# EAGLE design DigitalClockController (EAGLE 9.6.2)
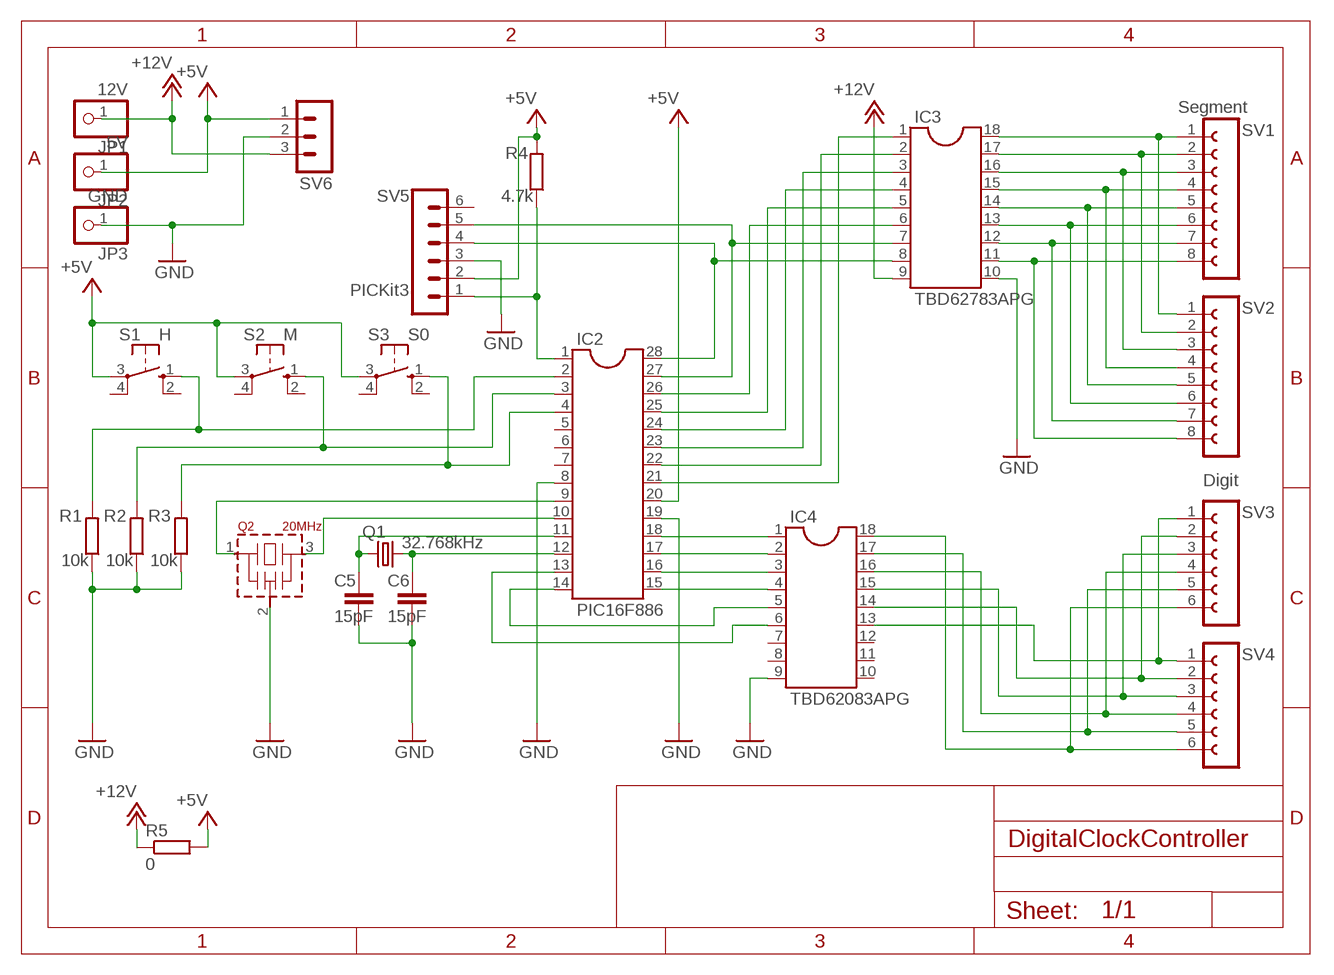
[diagram p0: schematic, sheet 1]

## Parts
C5  15pF  C-EU025-024X044  [C025-024X044]
C6  15pF  C-EU025-024X044  [C025-024X044]
IC2  PIC16F886  DIL28-3  [DIL28-3]
IC3  TBD62783APG  DIL18  [DIL18]
IC4  TBD62083APG  DIL18  [DIL18]
JP1  12V  PINHD-1X1  [1X01]
JP2  5V  PINHD-1X1  [1X01]
JP3  GND  PINHD-1X1  [1X01]
Q1  32.768kHz  CRYSTALTC26H  [TC26H]
Q2  20MHz  CSTLS_X  [CSTLS_X]
R1  10k  R-EU_0207/10  [0207/10]
R2  10k  R-EU_0207/10  [0207/10]
R3  10k  R-EU_0207/10  [0207/10]
R4  4.7k  R-EU_0207/10  [0207/10]
R5  0  R-EU_0207/10  [0207/10]
S1  H  10-XX  [B3F-10XX]
S2  M  10-XX  [B3F-10XX]
S3  S0  10-XX  [B3F-10XX]
SV1  Segment  FE08-1  [FE08]
SV2  Segment  FE08-1  [FE08]
SV3  Digit  FE06-1  [FE06]
SV4  Digit  FE06-1  [FE06]
SV5  PICKit3  MA06-1  [MA06-1]
SV6  MA03-1  [MA03-1]

## Nets
+5V: IC2.20 JP2.1 R4.2 R5.2 S1.3(P) S2.3(P) S3.3(P) SV5.2 SV6.1
+12V: IC3.9 JP1.1 R5.1 SV6.3
GND: C5.2 C6.2 IC2.8 IC2.19 IC3.10 IC4.9 JP3.1 Q2.2(VSS) R1.1 R2.1 R3.1 SV5.3 SV6.2
N$1: C5.1 IC2.11 Q1.2
N$2: C6.1 IC2.12 Q1.1
N$3: IC2.10 Q2.3
N$4: IC2.9 Q2.1
N$5: IC2.2 R1.2 S1.1(S)
N$6: IC2.3 R2.2 S2.1(S)
N$7: IC2.4 R3.2 S3.1(S)
N$8: IC2.1 R4.1 SV5.1
N$9: IC3.18 SV1.1 SV2.1
N$10: IC3.17 SV1.2 SV2.2
N$11: IC3.16 SV1.3 SV2.3
N$12: IC3.15 SV1.4 SV2.4
N$13: IC2.26 IC3.6
N$14: IC2.27 IC3.7 SV5.5
N$15: IC2.25 IC3.5
N$16: IC2.14 IC4.5
N$17: IC2.13 IC4.6
N$18: IC2.15 IC4.4
N$19: IC2.18 IC4.1
N$20: IC2.17 IC4.2
N$21: IC2.16 IC4.3
N$22: IC2.24 IC3.4
N$23: IC2.23 IC3.3
N$24: IC2.22 IC3.2
N$25: IC2.21 IC3.1
N$27: IC3.14 SV1.5 SV2.5
N$28: IC3.13 SV1.6 SV2.6
N$29: IC3.12 SV1.7 SV2.7
N$30: IC3.11 SV1.8 SV2.8
N$31: IC4.13 SV3.1 SV4.1
N$32: IC4.14 SV3.2 SV4.2
N$33: IC4.15 SV3.3 SV4.3
N$34: IC4.16 SV3.4 SV4.4
N$35: IC4.17 SV3.5 SV4.5
N$36: IC4.18 SV3.6 SV4.6
N$37: IC2.28 IC3.8 SV5.4
Unconnected: IC2.5 IC2.6 IC2.7 IC4.7 IC4.8 IC4.10 IC4.11 IC4.12 S1.2(S1) S1.4(P1) S2.2(S1) S2.4(P1) S3.2(S1) S3.4(P1) SV5.6

## Library data of the parts
C5 C6 = rcl:C-EU: CAPACITOR, European symbol; SPICEPREFIX: C
IC2 = ic-package:DIL28: Dual In Line
IC3 IC4 = ic-package:DIL18: Dual In Line / Socket
JP1-JP3 = pinhead:PINHD-1X1: PIN HEADER
Q1 = crystal:CRYSTAL: CRYSTAL; OC_FARNELL: unknown; OC_NEWARK: unknown
Q2 = murata-resonators:CSTLS_X: Ceramic resonator 16.00 to 70.00 MHz
R1-R5 = rcl:R-EU_: RESISTOR, European symbol; SPICEPREFIX: R
S1-S3 = switch-omron:10-XX: OMRON SWITCH; MPN: B3F-1000; OC_FARNELL: 176432; OC_NEWARK: 36M3542
SV1 SV2 = con-lsta:FE08-1: FEMALE HEADER; OC_FARNELL: unknown; OC_NEWARK: unknown
SV3 SV4 = con-lsta:FE06-1: FEMALE HEADER; OC_FARNELL: unknown; OC_NEWARK: unknown
SV5 = con-lstb:MA06-1: PIN HEADER; OC_FARNELL: unknown; OC_NEWARK: unknown
SV6 = con-lstb:MA03-1: PIN HEADER; OC_FARNELL: unknown; OC_NEWARK: unknown

## Board
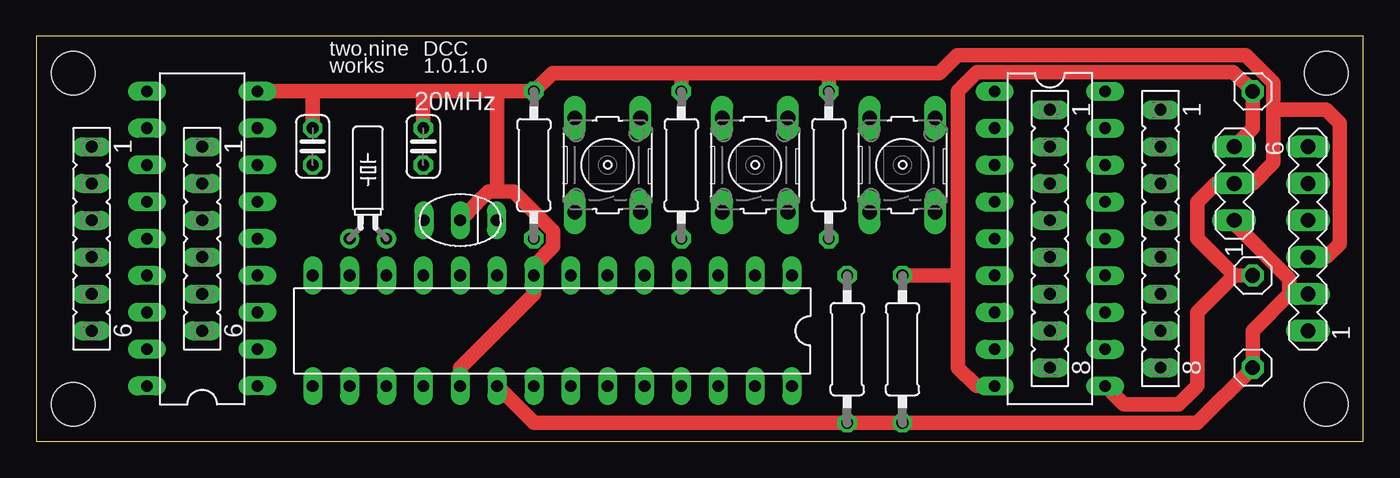
[diagram p1: board, top side]
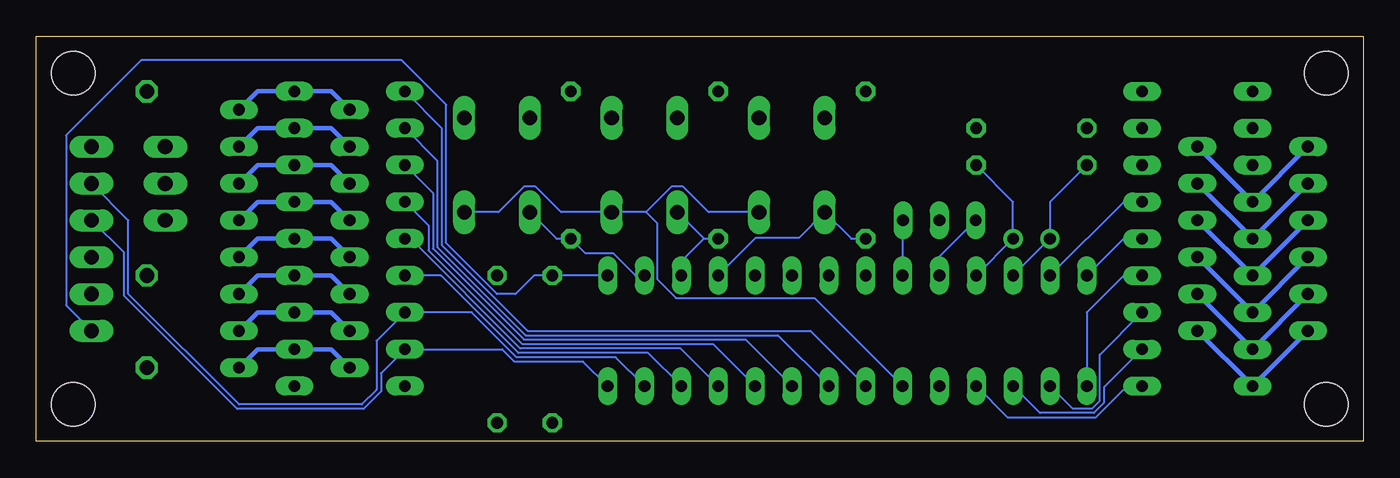
[diagram p2: board, bottom side, seen from below]

Size 91.44 x 27.93 mm. Coordinates in mm from the lower left corner, seen from the top.
Outline: 0,0 91.44,0 91.44,27.93 0,27.93 0,0
Copper layers (1*16): Top 0.035mm / dielectric 1.5mm / Bottom 0.035mm
Design rules "SeeedStudio_2layer_DRU_no_angle_20140221": minimum track width 6mil, minimum drill 12mil, track to track 6mil, track to pad 6mil, pad to pad 6mil, via to via 6mil, smd to smd 0mil, copper to edge 10mil, drill to drill 10mil, minimum pad ring 10mil, minimum via ring 6mil, stop-mask expansion 2mil, vias tented up to drill 100mil, thermal gap 10mil
Holes 3 mm at 2.54,25.4 2.54,2.54 88.9,2.54 88.9,25.4

### Footprints (pad centres in the part's own frame; a part is rotated, then mirrored left to right if it is on the bottom)
C025-024X044 = drill 0.813 octagon: 1 -1.27,0; 2 1.27,0
DIL28-3 = drill 0.813 long: 1 -16.51,-3.81; 2 -13.97,-3.81; 3 -11.43,-3.81; 4 -8.89,-3.81; 5 -6.35,-3.81; 6 -3.81,-3.81; 7 -1.27,-3.81; 8 1.27,-3.81; 9 3.81,-3.81; 10 6.35,-3.81; 11 8.89,-3.81; 12 11.43,-3.81; 13 13.97,-3.81; 14 16.51,-3.81; 15 16.51,3.81; 16 13.97,3.81; 17 11.43,3.81; 18 8.89,3.81; 19 6.35,3.81; 20 3.81,3.81; 21 1.27,3.81; 22 -1.27,3.81; 23 -3.81,3.81; 24 -6.35,3.81; 25 -8.89,3.81; 26 -11.43,3.81; 27 -13.97,3.81; 28 -16.51,3.81
DIL18 = drill 0.813 long: 1 -10.16,-3.81; 2 -7.62,-3.81; 3 -5.08,-3.81; 4 -2.54,-3.81; 5 0,-3.81; 6 2.54,-3.81; 7 5.08,-3.81; 8 7.62,-3.81; 9 10.16,-3.81; 10 10.16,3.81; 11 7.62,3.81; 12 5.08,3.81; 13 2.54,3.81; 14 0,3.81; 15 -2.54,3.81; 16 -5.08,3.81; 17 -7.62,3.81; 18 -10.16,3.81
1X01 = drill 1.016 octagon: 1 0,0
TC26H = drill 0.813: 1 -1.27,0; 2 1.27,0
CSTLS_X = drill 0.813 long: 1 -2.5,0; 2 0,0; 3 2.5,0
0207/10 = drill 0.813 octagon: 1 -5.08,0; 2 5.08,0
B3F-10XX = drill 1.016 long: 1 -3.251,2.261; 2 3.251,2.261; 3 -3.251,-2.261; 4 3.251,-2.261
FE08 = drill 0.813 long: 1 -8.89,0; 2 -6.35,0; 3 -3.81,0; 4 -1.27,0; 5 1.27,0; 6 3.81,0; 7 6.35,0; 8 8.89,0
FE06 = drill 0.813 long: 1 -6.35,0; 2 -3.81,0; 3 -1.27,0; 4 1.27,0; 5 3.81,0; 6 6.35,0
MA06-1 = drill 1.016 long: 1 -6.35,0; 2 -3.81,0; 3 -1.27,0; 4 1.27,0; 5 3.81,0; 6 6.35,0
MA03-1 = drill 1.016 long: 1 -2.54,0; 2 0,0; 3 2.54,0

### Placement (x,y rotation side)
C5  26.67,20.32 90 top
C6  19.05,20.32 90 top
IC2  35.56,7.62 180 top
IC3  69.85,13.97 270 top
IC4  11.43,13.97 90 top
JP1  83.82,24.13 0 top
JP2  83.82,5.08 0 top
JP3  83.82,11.43 0 top
Q1  22.86,13.97 0 top
Q2  29.21,15.24 180 top
R1  54.61,19.05 270 top
R2  44.45,19.05 270 top
R3  34.29,19.05 270 top
R4  55.88,6.35 270 top
R5  59.69,6.35 270 top
S1  59.69,19.05 90 top
S2  49.53,19.05 90 top
S3  39.37,19.05 90 top
SV1  77.47,13.97 270 top
SV2  69.85,13.97 270 top
SV3  3.81,13.97 270 top
SV4  11.43,13.97 270 top
SV5  87.63,13.97 90 top
SV6  82.55,17.78 90 top

### Tracks (layer width: path | path; a pad name or v marks a point on that pad's centre or on a via)
+5V
  Top 1.016: IC2.20 34.29,1.27 R4.2 R5.2 80.01,1.27 JP2.1 83.82,7.62 86.36,10.16 | 86.36,10.16 SV5.2 | 86.36,10.16 86.36,11.2 82.55,15.01 SV6.1
  Bottom 0.152: S3.3 45.11,15.8 46.86,17.55 47.68,17.55 49.43,15.8 | 49.43,15.8 S2.3 55.27,15.8 57.02,17.55 57.84,17.55 59.59,15.8 S1.3 | IC2.20 37.82,9.88 47.36,9.88 48.64,11.16 48.64,15.01 49.43,15.8
+12V
  Top 1.016: 63.5,11.43 63.5,24.13 64.82,25.45 82.5,25.45 JP1.1 83.82,21.59 SV6.3 | 63.5,11.43 63.5,5.08 64.77,3.81 IC3.9 | R5.1 63.5,11.43
GND
  Top 1.016: IC4.9 19.05,24.13 | 19.05,24.13 26.67,24.13 | 26.67,24.13 31.75,24.13 | 31.75,24.13 R3.1 35.56,25.4 44.45,25.4 | Q2.2 30.39,16.42 30.39,16.45 31.16,17.22 31.75,17.22 | 31.75,17.22 32.91,17.22 35.61,14.52 35.61,13.42 34.29,12.1 IC2.8 34.29,10.16 29.21,5.08 IC2.19 | 31.75,24.13 31.75,17.22 | C5.2 26.67,24.13 | C6.2 19.05,24.13 | 44.45,25.4 54.61,25.4 | 54.61,25.4 62.24,25.4 63.46,26.62 83.34,26.62 85.24,24.72 85.24,22.86 | R1.1 54.61,25.4 | R2.1 44.45,25.4 | IC3.10 74.93,2.54 78.74,2.54 80.01,3.81 80.01,8.89 82.55,11.43 | 85.24,22.86 85.24,19.2 83.82,17.78 SV6.2 81.28,17.78 80.01,16.51 80.01,13.97 82.55,11.43 | 82.55,11.43 JP3.1 | SV5.3 88.9,12.7 89.81,13.61 89.81,21.95 88.9,22.86 85.24,22.86
N$1
  Bottom 0.152: IC2.11 Q1.2 24.13,16.51 C5.1
N$2
  Bottom 0.152: C6.1 21.59,16.51 Q1.1 IC2.12
N$3
  Bottom 0.152: Q2.3 29.21,12.74 IC2.10
N$4
  Bottom 0.152: Q2.1 31.75,15.2 IC2.9
N$5
  Bottom 0.152: S1.1 55.6,13.97 R1.2 53.62,12.98 51.7,12.98 50.15,11.43 IC2.2
N$6
  Bottom 0.152: S2.1 45.44,13.97 | 45.44,13.97 R2.2 | IC2.3 46.99,12.42 45.44,13.97
N$7
  Bottom 0.152: IC2.4 41.83,14.05 38.86,14.05 S3.1 35.28,13.97 R3.2
N$8
  Bottom 0.152: IC2.1 R4.1 57.15,11.43 58.42,10.16 59.69,10.16 63.2,13.66 63.2,23.2 66.28,26.29 84.2,26.29 89.38,21.11 89.38,9.37 SV5.1
N$9
  Bottom 0.305: SV1.1 76.2,24.13 IC3.18 71.12,24.13 SV2.1
N$10
  Bottom 0.305: SV1.2 76.2,21.59 IC3.17 71.12,21.59 SV2.2
N$11
  Bottom 0.305: SV1.3 76.2,19.05 IC3.16 71.12,19.05 SV2.3
N$12
  Bottom 0.305: SV1.4 76.2,16.51 IC3.15 71.12,16.51 SV2.4
N$13
  Bottom 0.152: IC2.26 49.28,6.1 58.21,6.1 63.55,11.43 IC3.6
N$14
  Bottom 0.152: IC2.27 51.51,5.79 58.34,5.79 61.44,8.89 IC3.7 68,6.93 68,3.56 69.01,2.54 77.47,2.54 85.09,10.16 85.09,15.24 SV5.5
N$15
  Bottom 0.152: IC2.25 47.04,6.4 58.09,6.4 65.66,13.97 IC3.5
N$16
  Bottom 0.152: IC4.5 16.51,13.97 IC2.14
N$17
  Bottom 0.152: IC2.13 16.51,16.51 IC4.6
N$18
  Bottom 0.152: IC4.4 16.51,11.43 19.05,8.89 IC2.15
N$19
  Bottom 0.152: IC4.1 16.27,3.81 18.43,1.65 24.51,1.65 IC2.18
N$20
  Bottom 0.152: IC4.2 17.86,3.73 17.86,2.65 18.56,1.96 22.28,1.96 IC2.17
N$21
  Bottom 0.152: IC4.3 18.16,5.97 18.16,2.78 18.68,2.26 20.04,2.26 IC2.16
N$22
  Bottom 0.152: IC2.24 44.81,6.71 57.96,6.71 64.41,13.16 64.41,14.88 IC3.4
N$23
  Bottom 0.152: IC2.23 42.57,7.01 57.83,7.01 64.11,13.29 64.11,17.12 IC3.3
N$24
  Bottom 0.152: IC2.22 40.34,7.32 57.71,7.32 63.8,13.41 63.8,19.36 IC3.2
N$25
  Bottom 0.152: IC2.21 38.1,7.62 57.58,7.62 63.5,13.54 63.5,21.59 IC3.1
N$27
  Bottom 0.305: SV1.5 76.2,13.97 IC3.14 71.12,13.97 SV2.5
N$28
  Bottom 0.305: SV1.6 76.2,11.43 IC3.13 71.12,11.43 SV2.6
N$29
  Bottom 0.305: SV1.7 76.2,8.89 IC3.12 71.12,8.89 SV2.7
N$30
  Bottom 0.305: SV1.8 76.2,6.35 IC3.11 71.12,6.35 SV2.8
N$31
  Bottom 0.305: SV3.1 IC4.13 SV4.1
N$32
  Bottom 0.305: SV4.2 IC4.14 SV3.2
N$33
  Bottom 0.305: SV3.3 IC4.15 SV4.3
N$34
  Bottom 0.305: SV4.4 IC4.16 SV3.4
N$35
  Bottom 0.305: SV3.5 IC4.17 SV4.5
N$36
  Bottom 0.305: SV4.6 IC4.18 SV3.6
N$37
  Bottom 0.152: IC2.28 53.75,5.49 58.47,5.49 59.33,6.35 IC3.8 67.69,4.7 67.69,3.43 68.89,2.23 77.6,2.23 85.39,10.03 85.39,13.01 SV5.4

### Text on the board
tPlace: two.nine / works | DCC / 1.0.1.0